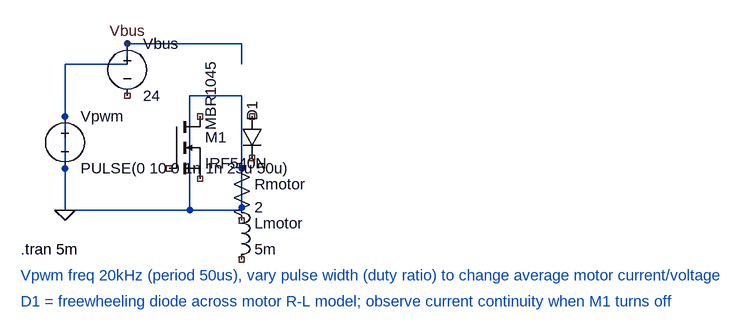
[diagram p0: schematic 13_chopper_motor_driver.asc]
13_chopper_motor_driver.asc, the LTspice schematic file:
Version 4
SHEET 1 880 680
WIRE 400 96 400 64
WIRE 400 64 224 64
WIRE 224 64 224 96
WIRE 400 176 400 144
WIRE 320 176 320 144
WIRE 320 144 400 144
WIRE 320 240 320 176
WIRE 400 240 400 176
WIRE 400 320 400 240
WIRE 320 320 320 240
WIRE 320 320 400 320
WIRE 128 176 128 96
WIRE 128 96 224 96
WIRE 128 320 128 176
WIRE 128 320 320 320
FLAG 128 320 0
FLAG 224 64 Vbus
SYMBOL voltage 128 160 R0
SYMATTR InstName Vpwm
SYMATTR Value PULSE(0 10 0 1n 1n 25u 50u)
SYMBOL voltage 224 48 R0
SYMATTR InstName Vbus
SYMATTR Value 24
SYMBOL nmos 288 176 R0
SYMATTR InstName M1
SYMATTR Value IRF540N
SYMBOL diode 400 176 R0
WINDOW 0 32 -8 VBottom 2
WINDOW 3 -32 -32 VBottom 2
SYMATTR InstName D1
SYMATTR Value MBR1045
SYMATTR SpiceLine Vfwd=0.5
SYMBOL res 384 240 R0
SYMATTR InstName Rmotor
SYMATTR Value 2
SYMBOL ind 384 300 R0
SYMATTR InstName Lmotor
SYMATTR Value 5m
TEXT 60 380 Left 2 !.tran 5m
TEXT 60 420 Left 2 ;Vpwm freq 20kHz (period 50us), vary pulse width (duty ratio) to change average motor current/voltage
TEXT 60 460 Left 2 ;D1 = freewheeling diode across motor R-L model; observe current continuity when M1 turns off

The netlist it stands for:
* 13_chopper_motor_driver.asc
Vpwm 0 0 PULSE(0 10 0 1n 1n 25u 50u)
Vbus 0 NC_01 24
M1 NC_02 NC_03 NC_04 NC_04 IRF540N
D1 NC_05 NC_06 MBR1045 Vfwd=0.5
Rmotor 0 NC_07 2
Lmotor 0 NC_08 5m
.model D D
.lib standard.dio
.model NMOS NMOS
.model PMOS PMOS
.lib standard.mos
.tran 5m
* Vpwm freq 20kHz (period 50us), vary pulse width (duty ratio) to change average motor current/voltage
* D1 = freewheeling diode across motor R-L model; observe current continuity when M1 turns off
.backanno
.end